# Altium schematic sheet SeptinaryAI_Balldi__elec_power__power_2023-07-21.schdoc
size 294 x 211 mm
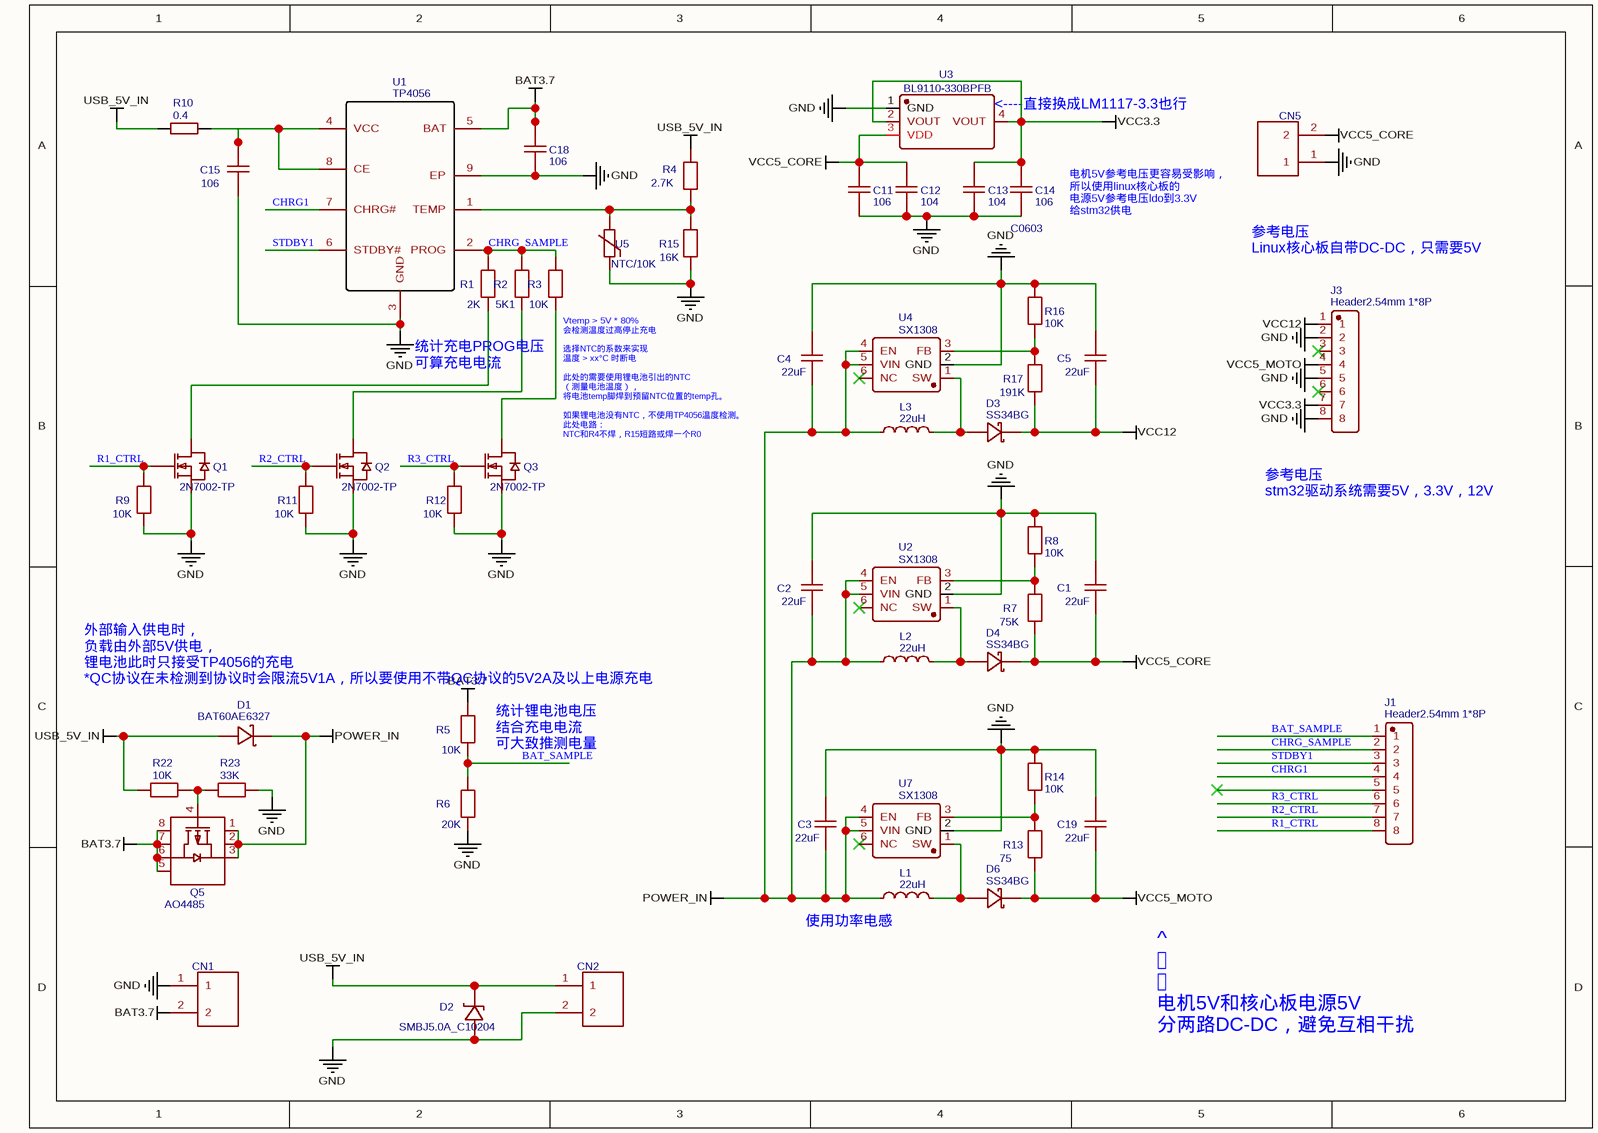
[diagram p0: SeptinaryAI_Balldi__elec_power__power_2023-07-21.schdoc]

## Parts
C1  22uF  [C0805]
C2  22uF  [C0805]
C3  22uF  [C0805]
C4  22uF  [C0805]
C5  22uF  [C0805]
C11  106  [C0603]
C12  104  [C0603]
C13  104  [C0603]
C14  106  [C0603]
C15  106  [C0603]
C18  106  [C0603]
C19  22uF  [C0805]
CN1  640454-2  [CONN-TH_640454-2]  (value not drawn)
CN2  640454-2  [CONN-TH_640454-2]  (value not drawn)
CN5  640454-2  [CONN-TH_640454-2]  (value not drawn)
D1  BAT60AE6327  [SOD-323_L1.8-W1.3-LS2.5-FD]
D2  SMBJ5.0A_C10204  [SMB_L4.6-W3.6-LS5.3-R-RD]
D3  SS34BG  [SMB_L4.6-W3.6-LS5.3-RD]
D4  SS34BG  [SMB_L4.6-W3.6-LS5.3-RD]
D6  SS34BG  [SMB_L4.6-W3.6-LS5.3-RD]
J1  Header2.54mm 1*8P  [HDR-TH_8P-P2.54-V-M]
J3  Header2.54mm 1*8P  [HDR-TH_8P-P2.54-V-M]
L1  22uH  [IND-SMD_L6.0-W6.0]
L2  22uH  [IND-SMD_L6.0-W6.0]
L3  22uH  [IND-SMD_L6.0-W6.0]
Q1  2N7002-TP  [SOT-23-3_L2.9-W1.3-P1.90-LS2.4-BR]
Q2  2N7002-TP  [SOT-23-3_L2.9-W1.3-P1.90-LS2.4-BR]
Q3  2N7002-TP  [SOT-23-3_L2.9-W1.3-P1.90-LS2.4-BR]
Q5  AO4485  [SOIC-8_L5.0-W4.0-P1.27-LS6.0-BL]
R1  2K  [R0603]
R2  5K1  [R0603]
R3  10K  [R0603]
R4  2.7K  [R0603]
R5  10K  [R0603]
R6  20K  [R0603]
R7  75K  [R0603]
R8  10K  [R0603]
R9  10K  [R0603]
R10  0.4  [R1206]
R11  10K  [R0603]
R12  10K  [R0603]
R13  75  [R0603]
R14  10K  [R0603]
R15  16K  [R0603]
R16  10K  [R0603]
R17  191K  [R0603]
R22  10K  [R0603]
R23  33K  [R0603]
U1  TP4056  [ESOP-8_L4.9-W3.9-P1.27-LS6.0-BL-EP]
U2  SX1308  [SOT-23-6_L2.9-W1.6-P0.95-LS2.8-BR]
U3  BL9110-330BPFB  [SOT-223_L6.5-W3.5-P2.30-LS7.0-BR]
U4  SX1308  [SOT-23-6_L2.9-W1.6-P0.95-LS2.8-BR]
U5  NTC/10K  [RES-TH_BD2.8_NTC-10K]
U7  SX1308  [SOT-23-6_L2.9-W1.6-P0.95-LS2.8-BR]

## Nets
BAT3.7: C18.2 CN1.2 Q5.5(D) Q5.6(D) Q5.7(D) Q5.8(D) R5.1 U1.5(BAT)
GND: C1.2 C2.2 C3.2 C4.2 C5.2 C11.1 C12.1 C13.1 C14.1 C15.1 C18.1 C19.2 CN1.1 CN2.2 CN5.1 D2.1(A) J3.2 J3.5 J3.8 Q1.2(S) Q2.2(S) Q3.2(S) R6.2 R8.2 R9.2 R11.2 R12.2 R14.2 R15.2 R16.2 R23.2 U1.3(GND) U1.9(EP) U2.2(GND) U3.1(GND) U4.2(GND) U5.1 U7.2(GND)
POWER_IN: C2.1 C3.1 C4.1 D1.2(K) L1.1 L2.1 L3.1 Q5.1(S) Q5.2(S) Q5.3(S) U2.4(EN) U2.5(VIN) U4.4(EN) U4.5(VIN) U7.4(EN) U7.5(VIN)
USB_5V_IN: CN2.1 D1.1(A) D2.2(K) R4.1 R10.1 R22.1
VCC3.3: C13.2 C14.2 J3.7 U3.2(VOUT) U3.4(VOUT)
VCC5_CORE: C1.1 C11.2 C12.2 CN5.2 D4.1(K) R7.2 U3.3(VDD)
VCC5_MOTO: C19.1 D6.1(K) J3.4 R13.2
VCC12: C5.1 D3.1(K) J3.1 R17.2
BAT_SAMPLE: J1.1 R5.2 R6.1
CHRG1: J1.4 U1.7(CHRG#)
CHRG_SAMPLE: J1.2 R1.1 R2.1 R3.1 U1.2(PROG)
R1_CTRL: J1.8 Q1.1(G) R9.1
R2_CTRL: J1.7 Q2.1(G) R11.1
R3_CTRL: J1.6 Q3.1(G) R12.1
STDBY1: J1.3 U1.6(STDBY#)
NetC15_2: C15.2 R10.2 U1.4(VCC) U1.8(CE)
NetD3_2: D3.2(A) L3.2 U4.1(SW)
NetD4_2: D4.2(A) L2.2 U2.1(SW)
NetD6_2: D6.2(A) L1.2 U7.1(SW)
NetQ1_3: Q1.3(D) R1.2
NetQ2_3: Q2.3(D) R2.2
NetQ3_3: Q3.3(D) R3.2
NetQ5_4: Q5.4(G) R22.2 R23.1
NetR4_2: R4.2 R15.1 U1.1(TEMP) U5.2
NetR7_1: R7.1 R8.1 U2.3(FB)
NetR13_1: R13.1 R14.1 U7.3(FB)
NetR16_1: R16.1 R17.1 U4.3(FB)

Not connected (* = marked no-connect by the designer): J1 5*; J3 3* 6*; U2 6(NC)*; U4 6(NC)*; U7 6(NC)*

## Notes on the sheet
- (near U3) <----直接换成LM1117-3.3也行
- 电机5V参考电压更容易受影响，
  所以使用linux核心板的
  电源5V参考电压ldo到3.3V
  给stm32供电
- (near J3) 参考电压
  Linux核心板自带DC-DC，只需要5V
- (near Q3) 统计充电PROG电压
  可算充电电流
- (near R3) Vtemp > 5V * 80%
  会检测温度过高停止充电
  选择NTC的系数来实现
  温度 > xx°C 时断电
  此处的需要使用锂电池引出的NTC
  （测量电池温度），
  将电池temp脚焊到预留NTC位置的temp孔。
  如果锂电池没有NTC，不使用TP4056温度检测。
  此处电路：
  NTC和R4不焊，R15短路或焊一个R0
- (near J3) 参考电压
  stm32驱动系统需要5V，3.3V，12V
- (near D1) 外部输入供电时，
  负载由外部5V供电，
  锂电池此时只接受TP4056的充电
  *QC协议在未检测到协议时会限流5V1A，所以要使用不带QC协议的5V2A及以上电源充电
- 统计锂电池电压
  结合充电电流
  可大致推测电量
- (near L1) 使用功率电感
- ^
  
  
  电机5V和核心板电源5V
  分两路DC-DC，避免互相干扰
- (in symbol 106) C0603

## Library data of the parts
C1-C5 C19 = 22uF: BOM_Manufacturer: SAMSUNG(三星); nameAlias: Capacitance; Contributor: LCSC; spicePre: C; spiceSymbolName: CL10F104ZO8NNNC
C11 = 106: BOM_Manufacturer: SAMSUNG(三星); BOM_Manufacturer Part: CL10F104ZO8NNNC; nameAlias: Capacitance; Contributor: LCSC; BOM_Supplier Part: C2762283; spicePre: C; spiceSymbolName: CL10F104ZO8NNNC
C12 C13 = 104: BOM_Manufacturer: SAMSUNG(三星); BOM_Manufacturer Part: CL10F104ZO8NNNC; nameAlias: Capacitance; Contributor: LCSC; BOM_Supplier Part: C2762283; spicePre: C; spiceSymbolName: CL10F104ZO8NNNC
C14 = 106: BOM_Manufacturer: SAMSUNG(三星); BOM_Manufacturer Part: CL10F104ZO8NNNC; nameAlias: Capacitance; Contributor: LCSC; Package Display: Yes; BOM_Supplier Part: C2762283; spicePre: C; spiceSymbolName: CL10F104ZO8NNNC
C15 C18 = 106: BOM_Manufacturer: SAMSUNG(三星); nameAlias: Capacitance; Contributor: LCSC; spicePre: C; spiceSymbolName: CL10F104ZO8NNNC
CN1 CN2 CN5 = 640454-2: BOM_Manufacturer: TE Connectivity; spicePre: C; spiceSymbolName: 640454-2
D1 = BAT60AE6327: BOM_Manufacturer: Infineon Technologies; Contributor: LCSC; spicePre: D; spiceSymbolName: BAT60AE6327HTSA1_C513277
D2 = SMBJ5.0A_C10204: BOM_Manufacturer: RUILON; spicePre: D; spiceSymbolName: SMBJ5.0A_C10204
D3 D4 D6 = SS34BG: BOM_Manufacturer: Shikues; Contributor: LCSC; BOM_Supplier: LCSC; BOM_Supplier Part: C719397; BOM_Manufacturer Part: SS34BG; BOM_JLCPCB Part Class: Extended Part; spicePre: D; spiceSymbolName: SS34BG
J1 J3 = Header2.54mm 1*8P: BOM_Manufacturer: ReliaPro; spicePre: J; spiceSymbolName: Header2.54mm 1*8P
L1-L3 = 22uH: BOM_Manufacturer: TDK; BOM_Manufacturer Part: SPM10040T-220M; nameAlias: Inductance; BOM_Supplier: LCSC; BOM_Supplier Part: C138686; BOM_JLCPCB Part Class: Extended Part; spicePre: L; spiceSymbolName: SPM10040T-220M
Q1-Q3 = 2N7002-TP: BOM_Manufacturer: MCC(Micro Commercial Components); Contributor: LCSC; spicePre: Q; spiceSymbolName: 2N7002-TP
Q5 = AO4485: BOM_Manufacturer: AOS; BOM_Supplier: LCSC; BOM_Manufacturer Part: AO4485; BOM_Supplier Part: C51499; BOM_JLCPCB Part Class: Extended Part; spicePre: Q; spiceSymbolName: AO4485
R1 = 2K: BOM_Manufacturer: VISHAY(威世); nameAlias: Resistance; Contributor: LCSC; spicePre: R; spiceSymbolName: TNPW0603130RBEEA
R2 = 5K1: BOM_Manufacturer: VISHAY(威世); nameAlias: Resistance; Contributor: LCSC; spicePre: R; spiceSymbolName: TNPW0603130RBEEA
R3 R5 R8 R9 R11 R12 R14 R16 R22 = 10K: BOM_Manufacturer: VISHAY(威世); nameAlias: Resistance; Contributor: LCSC; spicePre: R; spiceSymbolName: TNPW0603130RBEEA
R4 = 2.7K: BOM_Manufacturer: VISHAY(威世); nameAlias: Resistance; Contributor: LCSC; spicePre: R; spiceSymbolName: TNPW0603130RBEEA
R6 = 20K: BOM_Manufacturer: VISHAY(威世); nameAlias: Resistance; Contributor: LCSC; spicePre: R; spiceSymbolName: TNPW0603130RBEEA
R7 = 75K: BOM_Manufacturer: VISHAY(威世); nameAlias: Resistance; Contributor: LCSC; spicePre: R; spiceSymbolName: TNPW0603130RBEEA
R10 = 0.4: BOM_Manufacturer: UniOhm; nameAlias: Resistance (Ohms); spicePre: R; spiceSymbolName: 1206W4F500LT5E
R13 = 75: BOM_Manufacturer: VISHAY(威世); nameAlias: Resistance; Contributor: LCSC; spicePre: R; spiceSymbolName: TNPW0603130RBEEA
R15 = 16K: BOM_Manufacturer: VISHAY(威世); nameAlias: Resistance; Contributor: LCSC; spicePre: R; spiceSymbolName: TNPW0603130RBEEA
R17 = 191K: BOM_Manufacturer: VISHAY(威世); nameAlias: Resistance; Contributor: LCSC; spicePre: R; spiceSymbolName: TNPW0603130RBEEA
R23 = 33K: BOM_Manufacturer: VISHAY(威世); nameAlias: Resistance; Contributor: LCSC; spicePre: R; spiceSymbolName: TNPW0603130RBEEA
U1 = TP4056: BOM_Manufacturer: TOPPOWER; Contributor: Guest; spicePre: U; spiceSymbolName: TP4056
U2 U4 U7 = SX1308: BOM_Manufacturer: SX; sourceId: g4Yg9rJ1j; timeStamp: 1472247539; spicePre: U; spiceSymbolName: SX1308
U3 = BL9110-330BPFB: BOM_Manufacturer: BL; Contributor: LCSC; BOM_Manufacturer Part: BL9110-330BPFB; BOM_Supplier Part: C169246; spicePre: U; spiceSymbolName: BL9110-330BPFB
U5 = NTC/10K: BOM_Manufacturer: null; Contributor: LCSC; BOM_Supplier: LCSC; BOM_Supplier Part: C9900004021; BOM_Manufacturer Part: NTC/10K; BOM_JLCPCB Part Class: Extended Part; spicePre: U; spiceSymbolName: NTC/10K